# EAGLE design samplehold (EAGLE 7.4.0)

## Sheet 1 of 2
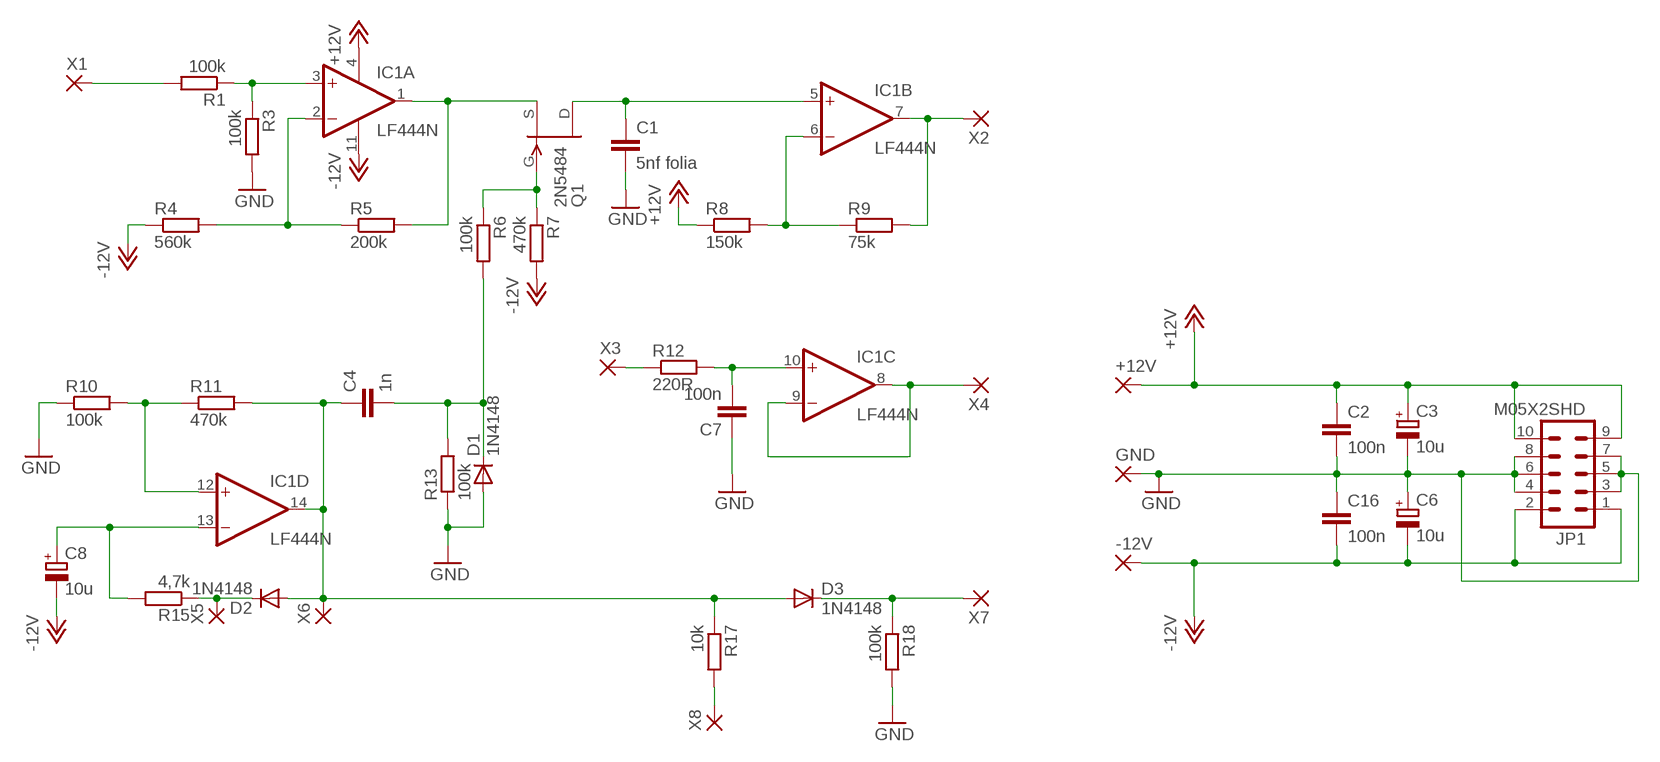
[diagram p0: schematic, sheet 1]

### Parts
+12V  2,54/1,0  [2,54/1,0]
-12V  2,54/1,0  [2,54/1,0]
C1  5nf folia  C-EU050-035X075  [C050-035X075]
C2  100n  C-EU050-035X075  [C050-035X075]
C3  10u  CPOL-EUE3.5-8  [E3,5-8]
C4  1n  C-EU050-035X075  [C050-035X075]
C6  10u  CPOL-EUE3.5-8  [E3,5-8]
C7  100n  C-EU050-035X075  [C050-035X075]
C8  10u  CPOL-EUE2.5-7  [E2,5-7]
C16  100n  C-EU050-035X075  [C050-035X075]
D1  1N4148  1N4148DO35-7  [DO35-7]
D2  1N4148  1N4148DO35-7  [DO35-7]
D3  1N4148  1N4148DO35-7  [DO35-7]
GND  2,54/1,0  [2,54/1,0]
IC1  LF444N  [DIL14]
JP1  M05X2SHD  [2X5-SHROUDED]
Q1  2N5484  [TO92-]
R1  100k  R-EU_0309/10  [0309/10]
R3  100k  R-EU_0309/10  [0309/10]
R4  560k  R-EU_0309/10  [0309/10]
R5  200k  R-EU_0309/10  [0309/10]
R6  100k  R-EU_0309/10  [0309/10]
R7  470k  R-EU_0309/10  [0309/10]
R8  150k  R-EU_0309/10  [0309/10]
R9  75k  R-EU_0309/10  [0309/10]
R10  100k  R-EU_0309/10  [0309/10]
R11  470k  R-EU_0309/10  [0309/10]
R12  220R  R-EU_0309/10  [0309/10]
R13  100k  R-EU_0309/10  [0309/10]
R15  4,7k  R-EU_0309/10  [0309/10]
R17  10k  R-EU_0309/10  [0309/10]
R18  100k  R-EU_0309/10  [0309/10]
X1  2,54/1,0  [2,54/1,0]
X2  2,54/1,0  [2,54/1,0]
X3  2,54/1,0  [2,54/1,0]
X4  2,54/1,0  [2,54/1,0]
X5  2,54/1,0  [2,54/1,0]
X6  2,54/1,0  [2,54/1,0]
X7  2,54/1,0  [2,54/1,0]
X8  2,54/1,0  [2,54/1,0]

### Nets
+12V: +12V.1(P) C2.1 C3.+ IC1.4(V+) JP1.9 JP1.10 R8.1 ; also sheet 2
-12V: -12V.1(P) C6.- C8.- C16.2 IC1.11(V-) JP1.1 JP1.2 R4.1 R7.2 ; also sheet 2
GND: C1.2 C2.2 C3.- C6.+ C7.1 C16.1 D1.A GND.1(P) JP1.3 JP1.4 JP1.5 JP1.6 JP1.7 JP1.8 R3.2 R10.1 R13.1 R18.2 ; also sheet 2
N$1: IC1.3(A:+IN) R1.1 R3.1
N$2: R1.2 X1.1(P)
N$3: IC1.1(A:OUT) Q1.2(S) R5.2
N$4: IC1.2(A:-IN) R4.2 R5.1
N$5: C1.1 IC1.5(B:+IN) Q1.3(D)
N$6: Q1.1(G) R6.1 R7.1
N$7: IC1.12(D:+IN) R10.2 R11.1
N$8: C4.2 D1.C R6.2 R13.2
N$9: IC1.6(B:-IN) R8.2 R9.1
N$10: IC1.7(B:OUT) R9.2 X2.1(P)
N$11: C4.1 D2.A D3.A IC1.14(D:OUT) R11.2 R17.1 X6.1(P)
N$12: C8.+ IC1.13(D:-IN) R15.2
N$13: D2.C R15.1 X5.1(P)
N$14: R17.2 X8.1(P)
N$15: D3.C R18.1 X7.1(P)
N$16: C7.2 IC1.10(C:+IN) R12.2
N$17: R12.1 X3.1(P)
N$18: IC1.8(C:OUT) IC1.9(C:-IN) X4.1(P)

## Sheet 2 of 2
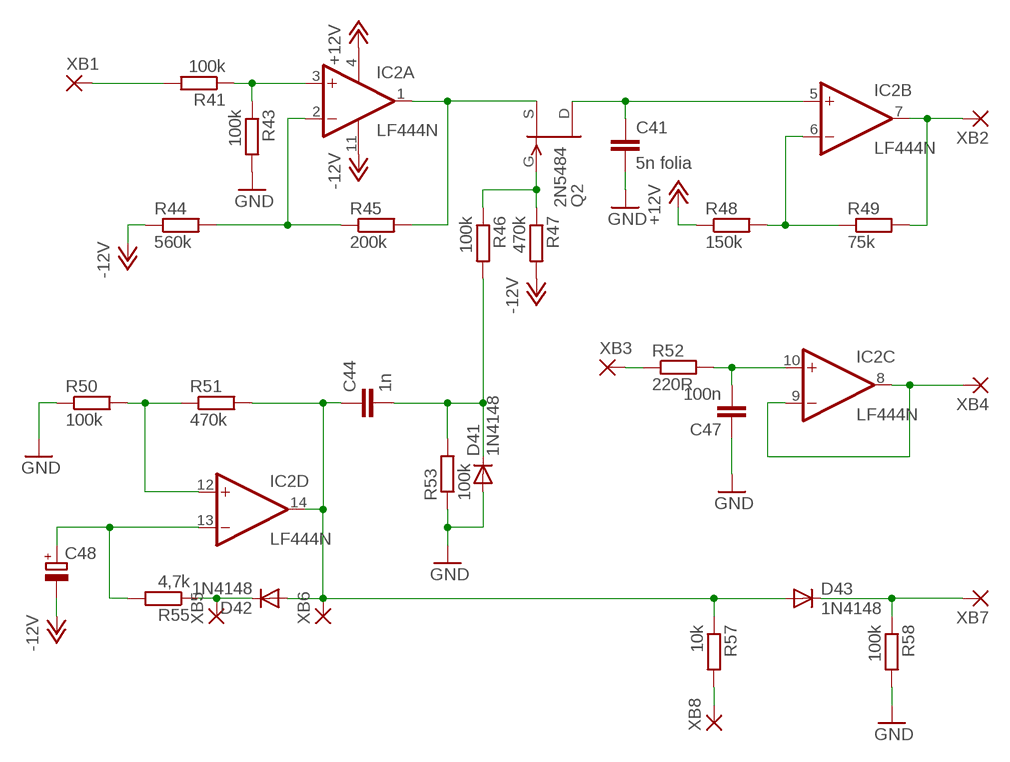
[diagram p1: schematic, sheet 2]

### Parts
C41  5n folia  C-EU050-035X075  [C050-035X075]
C44  1n  C-EU050-035X075  [C050-035X075]
C47  100n  C-EU050-035X075  [C050-035X075]
C48  CPOL-EUE2.5-7  [E2,5-7]
D41  1N4148  1N4148DO35-7  [DO35-7]
D42  1N4148  1N4148DO35-7  [DO35-7]
D43  1N4148  1N4148DO35-7  [DO35-7]
IC2  LF444N  [DIL14]
Q2  2N5484  [TO92-]
R41  100k  R-EU_0309/10  [0309/10]
R43  100k  R-EU_0309/10  [0309/10]
R44  560k  R-EU_0309/10  [0309/10]
R45  200k  R-EU_0309/10  [0309/10]
R46  100k  R-EU_0309/10  [0309/10]
R47  470k  R-EU_0309/10  [0309/10]
R48  150k  R-EU_0309/10  [0309/10]
R49  75k  R-EU_0309/10  [0309/10]
R50  100k  R-EU_0309/10  [0309/10]
R51  470k  R-EU_0309/10  [0309/10]
R52  220R  R-EU_0309/10  [0309/10]
R53  100k  R-EU_0309/10  [0309/10]
R55  4,7k  R-EU_0309/10  [0309/10]
R57  10k  R-EU_0309/10  [0309/10]
R58  100k  R-EU_0309/10  [0309/10]
XB1  2,54/1,0  [2,54/1,0]
XB2  2,54/1,0  [2,54/1,0]
XB3  2,54/1,0  [2,54/1,0]
XB4  2,54/1,0  [2,54/1,0]
XB5  2,54/1,0  [2,54/1,0]
XB6  2,54/1,0  [2,54/1,0]
XB7  2,54/1,0  [2,54/1,0]
XB8  2,54/1,0  [2,54/1,0]

### Nets
+12V: IC2.4(V+) R48.1 ; also sheet 1
-12V: C48.- IC2.11(V-) R44.1 R47.2 ; also sheet 1
GND: C41.2 C47.1 D41.A R43.2 R50.1 R53.1 R58.2 ; also sheet 1
N$19: IC2.3(A:+IN) R41.1 R43.1
N$20: R41.2 XB1.1(P)
N$21: IC2.1(A:OUT) Q2.2(S) R45.2
N$22: IC2.2(A:-IN) R44.2 R45.1
N$23: C41.1 IC2.5(B:+IN) Q2.3(D)
N$24: Q2.1(G) R46.1 R47.1
N$25: C44.2 D41.C R46.2 R53.2
N$26: IC2.6(B:-IN) R48.2 R49.1
N$27: IC2.7(B:OUT) R49.2 XB2.1(P)
N$28: IC2.12(D:+IN) R50.2 R51.1
N$29: C44.1 D42.A D43.A IC2.14(D:OUT) R51.2 R57.1 XB6.1(P)
N$30: C48.+ IC2.13(D:-IN) R55.2
N$31: D42.C R55.1 XB5.1(P)
N$32: R57.2 XB8.1(P)
N$33: D43.C R58.1 XB7.1(P)
N$34: C47.2 IC2.10(C:+IN) R52.2
N$35: R52.1 XB3.1(P)
N$36: IC2.8(C:OUT) IC2.9(C:-IN) XB4.1(P)

## Library data of the parts
+12V -12V GND X1-X8 XB1-XB8 = wirepad:2,54/1,0: THROUGH-HOLE PAD
C1 C2 C4 C7 C16 C41 C44 C47 = rcl:C-EU: CAPACITOR, European symbol
C3 C6 C8 C48 = rcl:CPOL-EU: POLARIZED CAPACITOR, European symbol
D1-D3 D41-D43 = diode:1N4148: DIODE high speed (Philips)
IC1 IC2 = cavalier:LF444
JP1 = SparkFun:M05X2: Header 5x2 Standard 10-pin dual row 0.1" header. Commonly used with AVR-ISP. Use with Spark Fun Electronics SKU: PRT-00778
Q1 Q2 = transistor-fet:?548*: N-Channel JFETs Source: VISHAY 2N5484.pdf Compatible: TO92 2N5245 J304 J305 U310 J308 J309 J310 TO72 2N4416 2N4416A 2N3823 2N4351 3N169 3N170 3N171 MFE3002 TO18 2N3796 2N3797 MFE825 Source: Motorola European Master Guide Pacge 3-59
R1 R3-R13 R15 R17 R18 R41 R43-R53 R55 R57 R58 = rcl:R-EU_: RESISTOR, European symbol

## Board
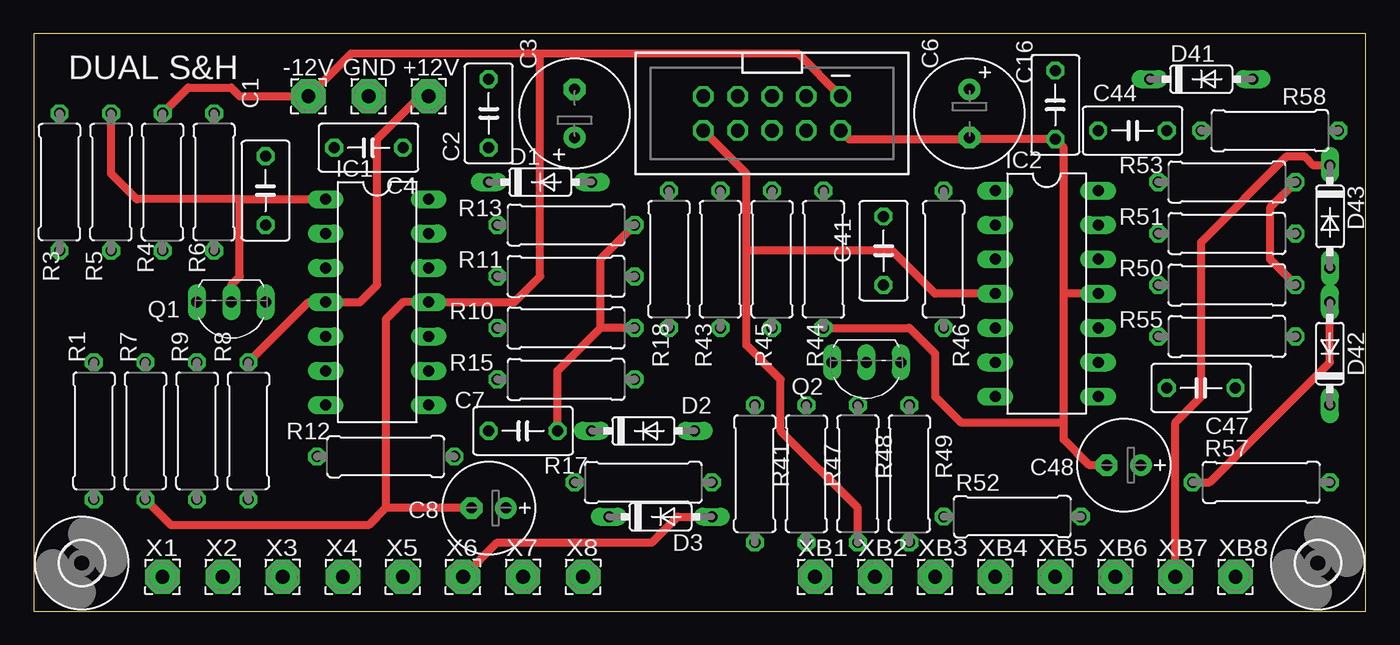
[diagram p2: board, top side]
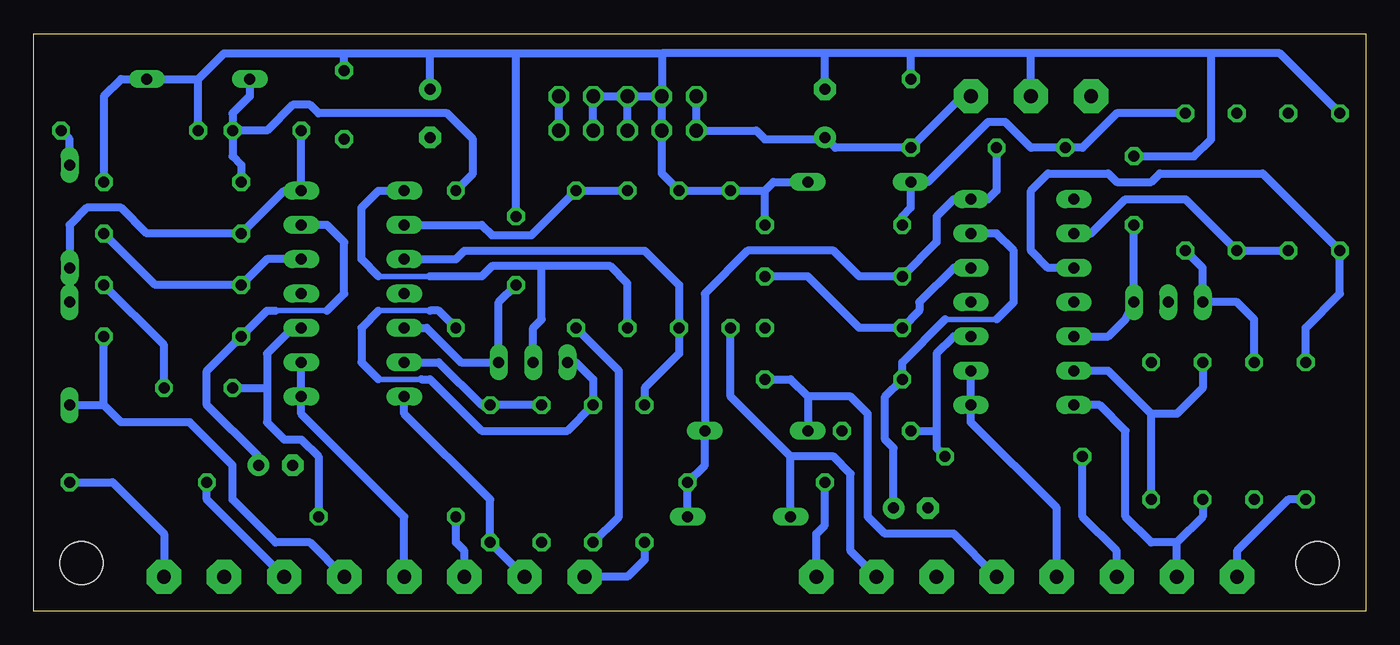
[diagram p3: board, bottom side, seen from below]

Size 98.53 x 42.72 mm. Coordinates in mm from the lower left corner, seen from the top.
Outline: 0,0 98.53,0 98.53,42.72 0,42.72 0,0
Copper layers (1*16): Top 0.035mm / dielectric 1.5mm / Bottom 0.035mm
Design rules "default": minimum track width 10mil, minimum drill 24mil, track to track 8mil, track to pad 8mil, pad to pad 8mil, via to via 8mil, smd to smd 8mil, copper to edge 40mil, drill to drill 8mil, minimum pad ring 10mil, minimum via ring 8mil, stop-mask expansion 4mil, vias tented up to drill 0mil, thermal gap 10mil

### Footprints (pad centres in the part's own frame; a part is rotated, then mirrored left to right if it is on the bottom)
2,54/1,0 = drill 1.016 pad 2.54 octagon: 1 0,0
C050-035X075 = drill 0.813 octagon: 1 -2.54,0; 2 2.54,0
E3,5-8 = drill 0.813 pad 1.6: + -1.778,0 | drill 0.813 pad 1.6 octagon: - 1.778,0
E2,5-7 = drill 0.813 pad 1.6: + -1.27,0 | drill 0.813 pad 1.6 octagon: - 1.27,0
DO35-7 = drill 0.813 long: A 3.81,0; C -3.81,0
DIL14 = drill 0.813 long: 1 -7.62,-3.81; 2 -5.08,-3.81; 3 -2.54,-3.81; 4 0,-3.81; 5 2.54,-3.81; 6 5.08,-3.81; 7 7.62,-3.81; 8 7.62,3.81; 9 5.08,3.81; 10 2.54,3.81; 11 0,3.81; 12 -2.54,3.81; 13 -5.08,3.81; 14 -7.62,3.81
2X5-SHROUDED = drill 1.016 octagon: 1 -1.27,5.08; 2 1.27,5.08; 3 -1.27,2.54; 4 1.27,2.54; 5 -1.27,0; 6 1.27,0; 7 -1.27,-2.54; 8 1.27,-2.54; 9 -1.27,-5.08; 10 1.27,-5.08
TO92- = drill 0.813 long: 1 2.54,0; 2 0,0; 3 -2.54,0
0309/10 = drill 0.813 octagon: 1 -5.08,0; 2 5.08,0
3,2 = hole 3.2: 0,0

### Placement (x,y rotation side)
+12V  29.21,38.1 0 top
-12V  20.32,38.1 0 top
C1  17.14,31.11 90 top
C2  33.66,36.83 90 top
C3  40.01,36.83 90 top
C4  24.77,34.29 180 top
C6  69.22,36.83 270 top
C7  36.2,13.34 180 top
C8  33.66,7.62 180 top
C16  75.56,37.47 270 top
C41  62.87,26.67 90 top
C44  81.28,35.56 0 top
C47  86.36,16.51 180 top
C48  80.64,10.79 180 top
D1  37.47,31.75 0 top
D2  45.09,13.34 0 top
D3  46.35,6.99 0 top
D41  86.36,39.37 0 top
D42  95.89,19.05 90 top
D43  95.89,29.21 270 top
GND  24.77,38.1 0 top
IC1  25.4,22.86 270 top
IC2  74.93,23.5 270 top
JP1  54.61,36.83 270 top
Q1  14.61,22.86 180 top
Q2  61.59,18.41 180 top
R1  4.45,13.34 270 top
R3  1.91,31.75 90 top
R4  9.53,31.75 270 top
R5  5.71,31.75 90 top
R6  13.34,31.75 90 top
R7  8.26,13.34 270 top
R8  15.88,13.34 270 top
R9  12.06,13.34 270 top
R10  39.37,20.95 180 top
R11  39.37,24.77 180 top
R12  26.04,11.43 0 top
R13  39.37,28.57 180 top
R15  39.37,17.14 180 top
R17  45.09,9.53 180 top
R18  46.99,26.04 90 top
R41  53.34,10.16 270 top
R43  50.8,26.04 90 top
R44  58.42,26.04 90 top
R45  54.61,26.04 270 top
R46  67.31,26.04 90 top
R47  57.15,10.16 270 top
R48  60.96,10.16 90 top
R49  64.77,10.16 270 top
R50  88.27,24.13 180 top
R51  88.27,27.94 180 top
R52  72.39,6.99 0 top
R53  88.27,31.75 180 top
R55  88.27,20.32 180 top
R57  90.81,9.53 0 top
R58  91.44,35.56 180 top
U$1  [3,2]  3.56,3.56 0 top
U$2  [3,2]  95,3.56 0 top
X1  9.53,2.54 0 top
X2  13.97,2.54 0 top
X3  18.41,2.54 0 top
X4  22.86,2.54 0 top
X5  27.3,2.54 0 top
X6  31.75,2.54 0 top
X7  36.2,2.54 0 top
X8  40.64,2.54 0 top
XB1  57.78,2.54 0 top
XB2  62.23,2.54 0 top
XB3  66.67,2.54 0 top
XB4  71.12,2.54 0 top
XB5  75.56,2.54 0 top
XB6  80.01,2.54 0 top
XB7  84.45,2.54 0 top
XB8  88.9,2.54 0 top

### Tracks (layer width: path | path; a pad name or v marks a point on that pad's centre or on a via)
+12V
  Top 0.61: 20.95,22.86 IC1.4 | IC1.4 24.13,22.86 25.4,24.13 25.4,34.92 28.57,38.1 +12V.1 | R48.1 60.96,7.62 55.24,13.34 55.24,17.14 52.7,19.68 52.7,26.67 | IC2.4 66.67,23.5 63.5,26.67 52.7,26.67 | 52.7,26.67 52.7,32.38 JP1.10 | R8.1 20.32,22.86 IC1.4
  Bottom 0.61: JP1.9 JP1.10 45.09,35.56 44.45,34.92 40.13,34.92 C3.+ 39.24,34.29 C2.1 29.84,38.1 +12V.1
-12V
  Top 0.61: JP1.2 60.33,34.92 69.09,34.92 C6.- 69.34,34.92 C16.2 76.2,34.29 76.2,23.5 | R4.1 11.43,38.73 14.61,38.73 15.24,38.1 -12V.1 23.5,41.27 37.47,41.27 | 37.47,41.27 56.52,41.27 JP1.1 | C8.- 26.04,7.62 | 26.04,7.62 24.77,6.35 10.16,6.35 R7.2 | 26.04,7.62 26.04,21.59 27.3,22.86 IC1.11 35.56,22.86 37.47,24.77 37.47,41.27 | 76.2,13.97 76.2,23.5 | IC2.11 76.2,23.5 | R44.1 64.77,20.95 66.67,19.05 66.67,15.88 68.58,13.97 76.2,13.97 | C48.- 78.11,10.79 76.2,12.7 76.2,13.97
  Bottom 0.61: JP1.2 JP1.1 | R47.2 55.24,6.99 55.24,17.78 R44.1
GND
  Top 0.61: C7.1 38.73,17.78 41.91,20.95 | 41.91,20.95 41.91,26.04 R13.1 | R10.1 41.91,20.95 | R53.1 91.44,29.84 91.44,26.04 R50.1
  Bottom 0.61: R3.2 6.35,41.27 11.43,41.27 | 11.43,41.27 24.77,41.27 | 24.77,41.27 33.66,41.27 | 33.66,41.27 40.01,41.27 | 40.01,41.27 52.07,41.27 | 52.07,41.27 JP1.7 | C1.2 12.7,33.66 11.43,34.92 11.43,41.27 | C2.2 33.66,41.27 | GND.1 24.77,41.27 | C3.- 40.01,41.27 | JP1.4 JP1.3 JP1.5 | JP1.5 JP1.7 | JP1.7 JP1.8 52.07,32.38 R43.2 R18.2 44.45,31.11 | JP1.6 JP1.5 | 86.36,39.37 D41.A 92.08,39.37 93.34,38.1 R53.1 | 86.36,39.37 84.45,41.27 75.56,41.27 | 75.56,41.27 69.22,41.27 | 69.22,41.27 62.87,41.27 | 62.87,41.27 52.07,41.27 | C6.+ 69.22,41.27 | C16.1 75.56,41.27 | R58.2 86.36,39.37 | 44.45,31.11 43.81,31.75 D1.A | R13.1 44.45,31.11 | C47.1 88.9,19.68 R50.1 | C41.2 62.87,41.27
N$1
  Bottom 0.61: R1.1 4.45,20.95 1.91,23.5 R3.1 7.62,32.38 15.24,32.38 15.88,31.75 18.41,31.75 19.05,32.38 23.5,32.38 24.77,31.11 24.77,26.67 23.5,25.4 IC1.3
N$2
  Bottom 0.61: R1.2 5.71,8.26 9.53,4.45 X1.1
N$3
  Top 0.61: 15.24,30.48 7.62,30.48 5.71,32.38 R5.2 | Q1.2 14.61,24.13 15.24,24.77 15.24,30.48 | 15.24,30.48 IC1.1
N$4
  Bottom 0.61: IC1.2 20.32,27.94 17.78,30.48 13.34,30.48 R4.2 R5.1
N$5
  Bottom 0.61: IC1.5 19.05,20.32 17.78,21.59 Q1.3 C1.1
N$6
  Bottom 0.61: R7.1 8.26,21.59 9.53,22.86 Q1.1 12.06,25.4 R6.1
N$7
  Bottom 0.61: IC1.12 30.48,25.4 33.02,22.86 33.02,22.23 R10.2 37.47,20.95 41.27,24.77 R11.1
N$8
  Bottom 0.61: R6.2 18.41,36.83 20.95,34.29 C4.2 24.77,34.29 26.67,36.2 27.94,36.2 32.38,31.75 D1.C 33.66,29.84 34.29,29.21 R13.2
N$9
  Bottom 0.61: R8.2 15.88,14.61 | 15.88,14.61 19.05,17.78 IC1.6 | R9.1 12.06,16.51 13.97,14.61 15.88,14.61
N$10
  Bottom 0.61: X2.1 13.97,5.08 | R9.2 12.06,6.99 13.97,5.08 | 13.97,5.08 15.88,5.08 17.78,6.99 17.78,13.34 19.68,15.24 IC1.7
N$11
  Top 0.61: X6.1 34.29,5.08 45.72,5.08 47.62,6.99 D3.A
  Bottom 0.61: C4.1 27.3,31.11 27.94,30.48 IC1.14 30.48,30.48 31.75,29.21 31.75,27.3 R11.2 37.47,24.77 39.37,26.67 45.72,26.67 48.9,23.5 D2.A 48.9,10.79 R17.1 D3.A
N$12
  Bottom 0.406: 31.11,21.59 27.3,21.59
  Bottom 0.61: C8.+ 34.92,12.06 35.56,12.7 35.56,15.88 R15.2 34.29,18.41 31.11,21.59 | 27.3,21.59 26.04,22.86 26.04,26.67 27.3,27.94 IC1.13
N$13
  Bottom 0.61: X5.1 30.48,5.71 35.56,5.71 36.83,6.99 36.83,14.61 38.1,15.88 41.27,15.88 | R15.1 42.55,17.14 41.27,15.88 | 41.27,15.88 D2.C
N$14
  Bottom 0.61: X8.1 40.64,5.71 40.01,6.35 R17.2
N$15
  Bottom 0.61: X7.1 38.1,4.45 38.1,10.16 39.37,11.43 42.55,11.43 | 42.55,11.43 46.99,15.88 R18.1 | D3.C 42.55,11.43
N$16
  Bottom 0.61: IC1.10 30.48,20.32 31.75,19.05 31.75,13.34 | 31.75,13.34 31.75,12.06 R12.2 | C7.2 31.75,13.34
N$17
  Bottom 0.61: X3.1 18.41,4.45 20.95,6.99 R12.1
N$18
  Bottom 0.61: X4.1 22.86,7.62 29.21,13.97 IC1.8 IC1.9
N$19
  Bottom 0.61: IC2.3 67.31,26.04 66.67,26.67 53.34,26.67 50.8,24.13 R43.1 50.8,19.05 53.34,16.51 R41.1
N$20
  Bottom 0.61: R41.2 53.34,3.81 54.61,2.54 XB1.1
N$21
  Bottom 0.406: 69.22,24.77 73.03,24.77
  Bottom 0.61: R45.2 54.61,24.26 55.88,25.53 60.96,25.53 | 60.96,25.53 64.64,25.53 65.41,24.77 69.22,24.77 | 73.03,24.77 74.3,26.04 74.3,29.84 73.03,31.11 IC2.1 | Q2.2 61.59,20.95 60.96,21.59 60.96,25.53
N$22
  Bottom 0.61: IC2.2 65.41,28.57 64.64,27.81 61.72,27.81 R44.2 R45.1
N$23
  Bottom 0.61: IC2.5 69.47,20.95 66.93,18.41 Q2.3 64.14,22.86 C41.1
N$24
  Bottom 0.406: 69.22,22.23 73.03,22.23 | 73.03,17.14 69.85,17.14
  Bottom 0.61: R46.1 68.58,22.23 69.22,22.23 | 73.03,22.23 74.3,20.95 74.3,18.41 73.03,17.14 | 69.85,17.14 69.22,17.14 65.41,13.34 59.05,13.34 R47.1 57.15,17.14 58.42,18.41 Q2.1
N$25
  Bottom 0.61: R46.2 66.04,32.38 66.04,34.92 67.94,36.83 77.47,36.83 78.11,37.47 79.38,37.47 81.28,35.56 C44.2 | R53.2 83.19,33.02 83.82,33.66 C44.2 | D41.C 82.55,38.1 83.82,36.83 C44.2
N$26
  Bottom 0.61: R48.2 R49.1 65.41,15.24 68.58,18.41 IC2.6
N$27
  Bottom 0.61: IC2.7 71.12,14.61 64.77,8.26 R49.2 XB2.1
N$28
  Bottom 0.61: IC2.12 81.28,26.04 R50.2 89.53,24.13 R51.1
N$29
  Top 0.61: R57.1 87,9.53 95.89,18.41 D42.A
  Bottom 0.61: C44.1 IC2.14 80.01,31.11 R51.2 90.17,27.94 92.08,29.84 94.61,29.84 95.89,28.57 D43.A D42.A | XB6.1 85.72,8.26 R57.1
N$30
  Bottom 0.406: 80.64,22.23 76.83,22.23
  Bottom 0.61: 80.64,22.23 81.28,22.23 R55.2 85.72,17.78 85.72,15.24 81.92,11.43 C48.+ | 76.83,22.23 75.56,23.5 75.56,27.3 76.83,28.57 IC2.13
N$31
  Bottom 0.61: 93.34,15.24 92.08,13.97 87,13.97 83.82,10.79 83.82,8.26 80.64,5.08 78.11,5.08 XB5.1 | 93.34,15.24 R55.1 | D42.C 93.34,15.24
N$32
  Bottom 0.61: R57.2 92.71,9.53 88.9,5.71 XB8.1
N$33
  Top 0.61: XB7.1 84.45,13.97 86.36,15.88 86.36,27.3 92.71,33.66 93.98,33.66 94.61,33.02 D43.C
  Bottom 0.61: D43.C 95.89,34.92 R58.1
N$34
  Bottom 0.61: IC2.10 79.38,20.95 81.28,19.05 81.28,16.51 | 81.28,16.51 81.28,13.97 80.01,12.7 78.74,12.7 77.47,11.43 R52.2 | C47.2 81.28,16.51
N$35
  Bottom 0.61: XB3.1 66.67,4.45 67.31,5.08 R52.1
N$36
  Bottom 0.61: IC2.9 IC2.8 78.74,14.61 71.12,6.99 XB4.1

### Text on the board
tPlace: DUAL S&H